# Altium schematic sheet 78M05_RT9193.SchDoc
size A4; SheetNumber: 4; SheetTotal: 7
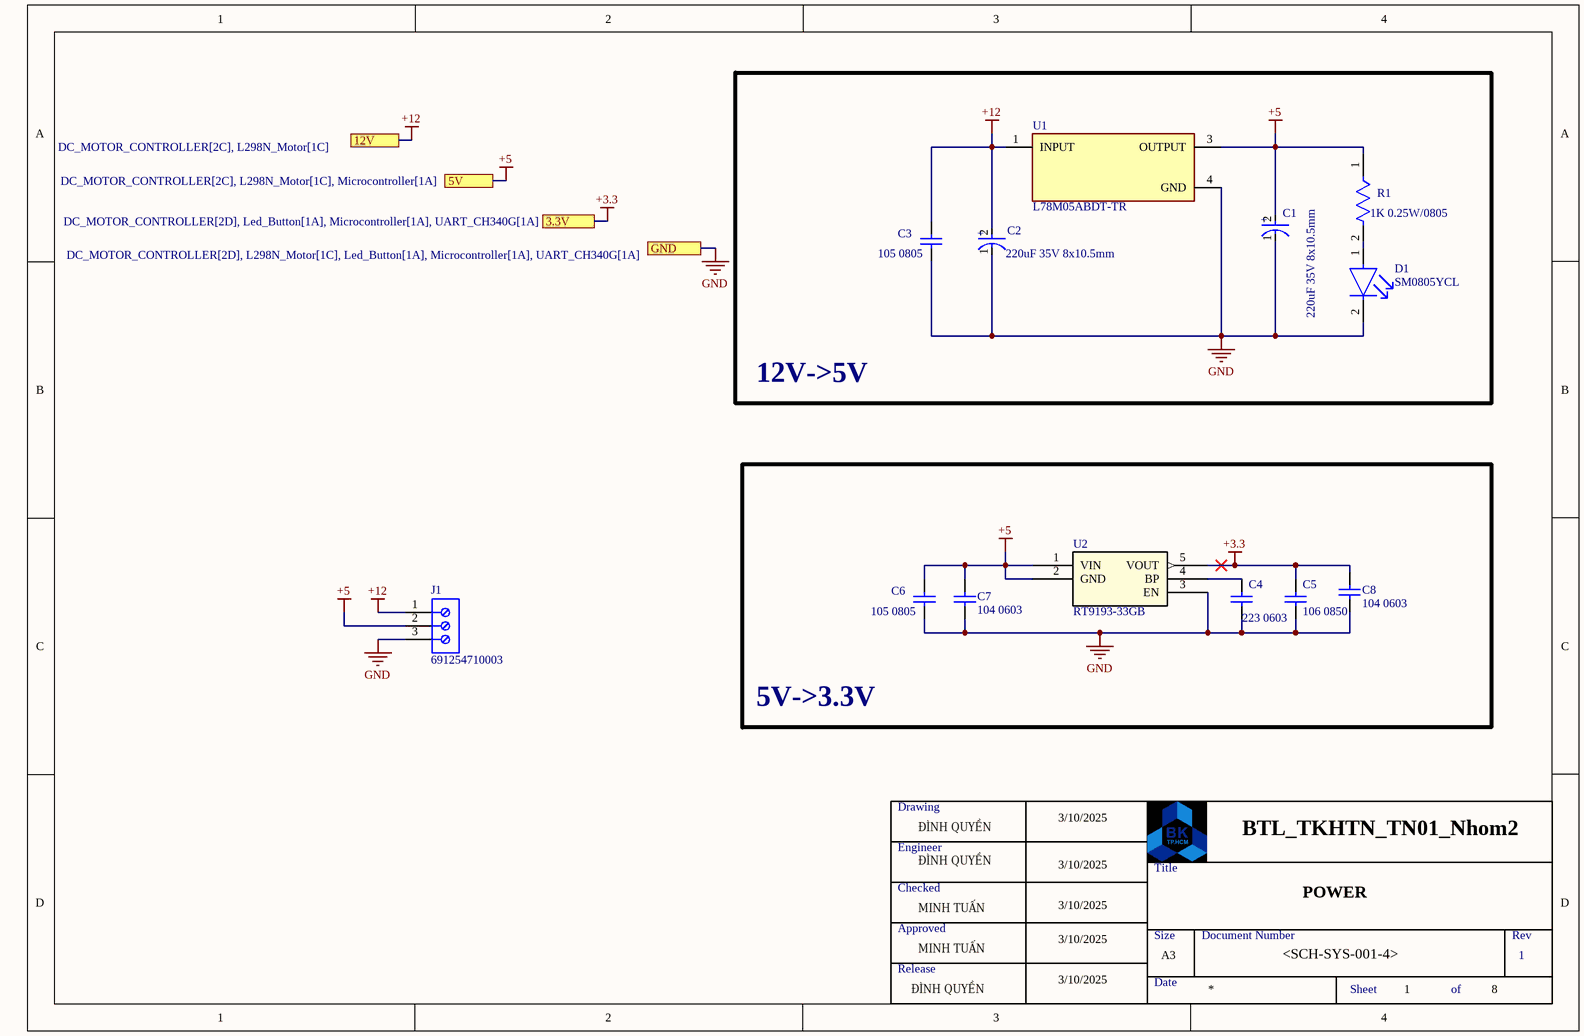
[diagram p0: 78M05_RT9193.SchDoc]

## Parts
C1  220uF 35V 8x10.5mm  [FP-FPF-MFG]
C2  220uF 35V 8x10.5mm  [FP-FPF-MFG]
C3  105 0805  [CAPC0805(2012)145_M]
C4  223 0603  [CAPC1608X92X38ML15T08]
C5  106 0850  [CAPC0805(2012)145_M]
C6  105 0805  [CAPC0805(2012)145_M]
C7  104 0603  [CAPC1608X92X38ML15T08]
C8  104 0603  [CAPC1608X92X38ML15T08]
D1  SM0805YCL  [FP-SM0805YCL-MFG]
J1  691254710003  [691254710003]
R1  1K 0.25W/0805  [FP-AF0805-IPC_C]
U1  L78M05ABDT-TR  [FP-L78M05ABDT-TR-MFG]
U2  RT9193-33GB  [SOT-23-5_RIT]

## Blocks framed on the sheet
12V->5V: C1-C3 D1 R1 U1
5V->3.3V: C4-C8 U2

## Ports
3.3V (see DC_MOTOR_CONTROLLER[2D], Led_Button[1A], Microcontroller[1A], UART_CH340G[1A]), 5V (see DC_MOTOR_CONTROLLER[2C], L298N_Motor[1C], Microcontroller[1A]), 12V (see DC_MOTOR_CONTROLLER[2C], L298N_Motor[1C]), GND (see DC_MOTOR_CONTROLLER[2D], L298N_Motor[1C], Led_Button[1A], Microcontroller[1A], UART_CH340G[1A])

## Nets
+3.3: C5.2 C8.2 U2.5(VOUT) ; port 3.3V
+5: C1.2(A) C6.2 C7.2 J1.2 R1.1 U1.3(OUTPUT) U2.1(VIN) U2.2(GND) ; port 5V
+12: C2.2(A) C3.2 J1.1 U1.1(INPUT) ; port 12V
GND: C1.1(C) C2.1(C) C3.1 C4.1 C5.1 C6.1 C7.1 C8.1 D1.2(C) J1.3 U1.4(GND) U2.3(EN) ; port GND
NetC4_2: C4.2 U2.4(BP)
NetD1_1: D1.1(A) R1.2

## Notes on the sheet
- Drawing
- Engineer
- ĐÌNH QUYỀN
- 3/10/2025
- BTL_TKHTN_TN01_Nhom2
- Checked
- MINH TUẤN
- Title
- POWER
- Approved
- Release
- Size
- Date
- A3
- Document Number
- <SCH-SYS-001-4>
- Rev
- 1
- Sheet
- of
- 8
- (in symbol CMP-2000-06215-2) +

## Library data of the parts
C1 C2 = CMP-2000-06215-2: CAP ALUM 220UF 20% 35V SMD; Ripple Current (AC): 850mA; Life (Hours): 2000Hour; Polarity: Polar; ESR (Equivalent Series Resistance): 80mR; Material: Aluminium; Leakage Current: 77uA; RoHS Compliant: Yes; Number of Pins: 2; Length: 10.5mm; Height - Seated (Max): 0.402inch; Lead Pitch: 3.1mm; Construction: Cylindrical; Contact Plating: Tin; Tolerance: 20%; Voltage: 35V; REACH SVHC: No SVHC; Capacitance: 220uF; Width: 8.3mm; Max Operating Temperature: 105°C; Mount: Surface Mount; Package Quantity: 500; Min Operating Temperature: -55°C; Diameter: 8mm; Voltage Rating (DC): 35V; Packaging: Tape and Reel; Termination: SMD/SMT; Ripple Current: 850mA; Series: FP; Radiation Hardening: No; Case/Package: Radial; Voltage Rating: 35V; Height: 10.2mm; Lead Free: Lead Free
C3 C5 C6 = CMP-1036-03968-1: CAP 15nF 100V ±10% 0805 (2012 Metric) Thickness 1.45mm SMD; Tolerance: Â±10%; Case-Metric: 2012; Case-EIA: 0805; Rated Voltage: 100 V; Max Thickness: 1.45 mm; Technology: SMT; Value: 15nF
C4 C7 C8 = CMP-2006-01201-1: Manufacturer: Vitramon; Part Number: VJ0603Y103JXXAC
D1 = CMP-35283-000007-1: LED YELLOW CLEAR 0805 SMD; Luminous Intensity: 11.5mcd; Test Current: 2mA; Viewing Angle: 130°; Dominant Wavelength: 592nm; Forward Voltage: 1.9V; Lens Color: Colorless; Case Code (Metric): 2012; Illumination Color: Yellow; Length: 2mm; Max Operating Temperature: 80°C; Width: 1.2mm; Case Code (Imperial): 0805; Packaging: Tape and Reel; Lens Transparency: Clear; Mount: Surface Mount; Case/Package: 0805; Forward Current: 2mA; Height: 0.8mm; Lead Free: Lead Free; Min Operating Temperature: -30°C; Color: Yellow; Package Quantity: 4000
J1 = CMP-1502-02592-2: NexarPartId: 105950850
R1 = CMP-03412-045285-1: Anti-Sulfurated Chip Resistor Automotive Grade 75Ω 1% 0.125W ±100ppm/°C 0805; Max Power Dissipation: 125mW; Resistance: 75R; Resistor Type: Thick Film; Number of Terminations: 2; Min Operating Temperature: -55°C; Packaging: Tape and Reel; Height: 0.024inch; Max Operating Temperature: 155°C; Series: AF; Case/Package: 0805; Tolerance: 1%; Length: 0.079inch; Width: 0.049inch; Features: Moisture Resistant; RoHS Compliant: Yes; Temperature Coefficient: 100ppm/°C
U1 = CMP-0244-00177-2: IC REG LINEAR 5V 500MA DPAK; Polarity: Positive; Accuracy: 2%; Max Input Voltage: 35V; Tolerance: 4%; Power Supply Rejection Ratio (PSRR): 62dB; Dropout Voltage: 2V; Output Type: Fixed; Number of Regulators: 1; Min Input Voltage: 10V; Quiescent Current: 6mA; Mount: Surface Mount; Min Operating Temperature: -40°C; Lead Free: Lead Free; Number of Pins: 3; Height: 2.4mm; Weight: 0.01lb; Width: 6.2mm; Packaging: Tape and Reel; Output Current: 500mA; Output Voltage: 5V; Case/Package: TO-252; REACH SVHC: No SVHC; Max Operating Temperature: 125°C; Nominal Output Voltage: 5V; Number of Outputs: 1; Min Output Voltage: 5V; Radiation Hardening: No; Length: 6.6mm; Max Output Current: 500mA; Contact Plating: Tin; Output Voltage Accuracy: 2%; Package Quantity: 1
U2 = RT9193-33GB: No Description Available; Manufacturer_Name: Richtek Technology; Copyright: Copyright (C) 2025 Ultra Librarian. All rights reserved.; Manufacturer_Part_Number: RT9193-33GB; RefDes: RefDes; Type: Type